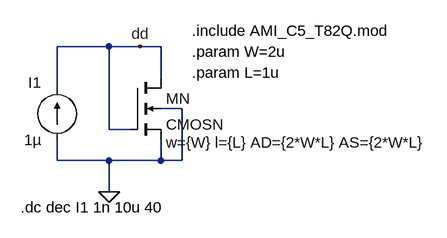
[diagram p0: schematic mos_AD_AS.asc]
mos_AD_AS.asc, the LTspice schematic file:
Version 4
SHEET 1 880 680
WIRE 144 64 64 64
WIRE 192 64 144 64
WIRE 224 64 192 64
WIRE 224 112 224 64
WIRE 64 128 64 64
WIRE 256 160 224 160
WIRE 144 192 144 64
WIRE 176 192 144 192
WIRE 64 240 64 208
WIRE 144 240 64 240
WIRE 224 240 224 208
WIRE 224 240 144 240
WIRE 256 240 256 160
WIRE 256 240 224 240
WIRE 144 288 144 240
FLAG 144 288 0
FLAG 192 64 dd
SYMBOL nmos4 176 112 R0
WINDOW 123 56 100 Left 0
SYMATTR Value2 w={W} l={L} AD={2*W*L} AS={2*W*L}
SYMATTR InstName MN
SYMATTR Value CMOSN
SYMBOL current 64 208 R180
WINDOW 0 24 88 Left 0
WINDOW 3 24 0 Left 0
SYMATTR InstName I1
SYMATTR Value 1µ
TEXT 272 72 Left 0 !.param W=2u
TEXT 272 104 Left 0 !.param L=1u
TEXT 272 40 Left 0 !.include AMI_C5_T82Q.mod
TEXT 8 312 Left 0 !.dc dec I1 1n 10u 40

The netlist it stands for:
* mos_AD_AS.asc
MN dd dd 0 0 CMOSN w={W} l={L} AD={2*W*L} AS={2*W*L}
I1 0 dd 1µ
.model NMOS NMOS
.model PMOS PMOS
.lib standard.mos
.param W=2u
.param L=1u
.include AMI_C5_T82Q.mod
.dc dec I1 1n 10u 40
.backanno
.end